# EAGLE board BLE_POV_clock_v2.0 (EAGLE 9.6.2)
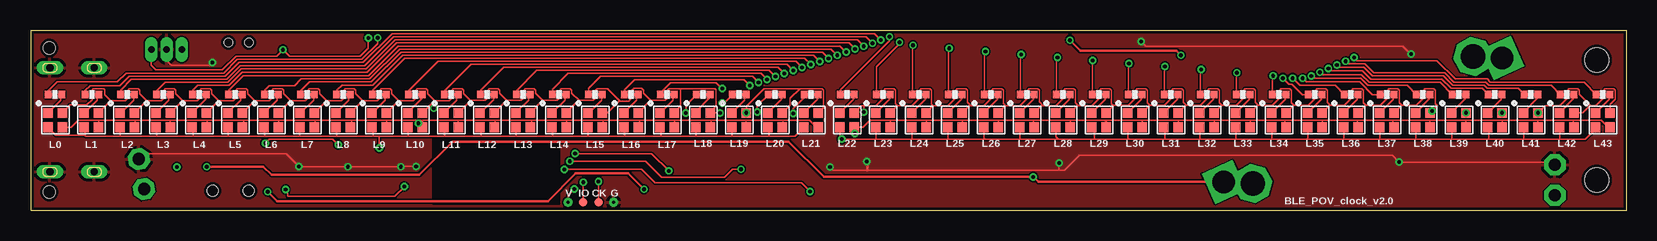
[diagram p2: board, top side]
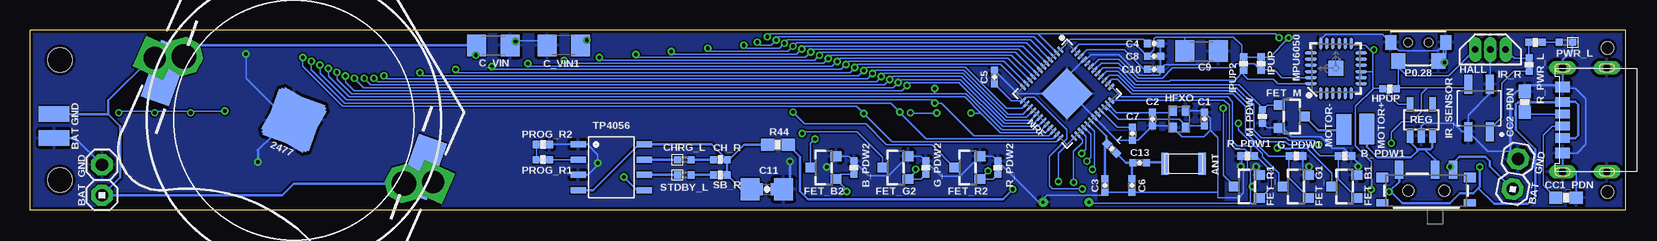
[diagram p3: board, bottom side, seen from below]

Size 133 x 15 mm. Coordinates in mm from the lower left corner, seen from the top.
Outline: 133,0 133,15 0,15 0,0 133,0
Copper layers (1*16): Top 0.035mm / dielectric 1.5mm / Bottom 0.035mm
Design rules "SeeedStudio_2layer_DRU_no_angle_20140221 *": minimum track width 5mil, minimum drill 12mil, track to track 5mil, track to pad 5mil, pad to pad 5mil, via to via 5mil, smd to smd 0mil, copper to edge 10mil, drill to drill 10mil, minimum pad ring 10mil, minimum via ring 6mil, stop-mask expansion 2mil, vias tented up to drill 100mil, thermal gap 10mil
Net classes: 1 pwr: width 0.203 mm
Holes 2 mm at 130.5,2.5 130.5,12.5
Holes 1 mm at 1.5,13.5 1.5,1.5
tRestrict: area 33.5,0.5 to 44,6.5
bRestrict: area 33.5,0.5 to 44,6.5

## Footprints (pad centres in the part's own frame; a part is rotated, then mirrored left to right if it is on the bottom)
CR2477_PTH = smd 4.064 x 4.064: GND 0,0 | drill 1.854 square: V+1 -12.7,0; V+2 12.7,0
ANT3216LL00R2400A = smd 1.8 x 0.6: P1 0,1.55; P2 0,-1.55
0402-RES = smd 0.6 x 0.6: 1 -0.55,0; 2 0.55,0
1X02 = drill 1.016 pad 1.778 octagon: 1 -1.27,0; 2 1.27,0
PAD_50X100MIL = smd 1.27 x 2.54: P$1 0,0
0402-CAP = smd 0.6 x 0.6: 1 -0.55,0; 2 0.55,0
1206 = smd 1.6 x 1.8: 1 -1.4,0; 2 1.4,0
0603|1206 = smd 1.1 x 1: 1 -0.85,0; 2 0.85,0 | smd 1.6 x 1.8: P$1 -1.4,0; P$2 1.4,0
0603-RES = smd 1.1 x 1: 1 -0.85,0; 2 0.85,0
0402 = smd 0.6 x 0.6: A -0.55,0; C 0.55,0
SOT23-3 = smd 0.8 x 0.9: 1 -0.95,-1; 2 0.95,-1; 3 0,1.1
TO92_HALLSENSOR = drill 0.55 pad 1.016 long: GND 0,0; OUT -1.27,0; VCC 1.27,0
XTAL_CX2016DB16000D0WZRC1 = smd 0.8 x 0.7: 1 -0.7,-0.55; 2 0.7,-0.55; 3 0.7,0.55; 4 -0.7,0.55
SOIC180P460X187-4N = smd 0.69 x 1.57: 1 -0.9,1.975; 2 -0.9,-1.975; 3 0.9,-1.975; 4 0.9,1.975
0402' = smd 0.6 x 0.6: 1 -0.55,0; 2 0.55,0
LED_RGB_0606 = smd 0.8 x 0.8: B -0.6,-0.6; COM -0.6,0.6; G 0.6,-0.6; R 0.6,0.6
QFN-24-EP = smd 1.016 x 0.254: 1 -2.066,1.257; 2 -2.066,0.75; 3 -2.066,0.247; 4 -2.066,-0.287; 5 -2.066,-0.792; 6 -2.066,-1.297; 13 2.086,-1.297; 14 2.086,-0.792; 15 2.086,-0.287; 16 2.086,0.247; 17 2.086,0.75; 18 2.086,1.257 | smd 0.254 x 1.016: 7 -1.267,-2.122; 8 -0.762,-2.122; 9 -0.258,-2.122; 10 0.278,-2.122; 11 0.78,-2.122; 12 1.287,-2.122; 19 1.287,2.082; 20 0.78,2.082; 21 0.278,2.082; 22 -0.258,2.082; 23 -0.762,2.082; 24 -1.267,2.082 | smd 1.27 x 1.27: P$1 0.02,-0.01
NRF52810_QFN40P600X600X90-48_N_3MMTHERMAL = smd 0.65 x 0.2: 1 -3,2.2; 2 -3,1.8; 3 -3,1.4; 4 -3,1; 5 -3,0.6; 6 -3,0.2; 7 -3,-0.2; 8 -3,-0.6; 9 -3,-1; 10 -3,-1.4; 11 -3,-1.8; 12 -3,-2.2; 25 3,-2.2; 26 3,-1.8; 27 3,-1.4; 28 3,-1; 29 3,-0.6; 30 3,-0.2; 31 3,0.2; 32 3,0.6; 33 3,1; 34 3,1.4; 35 3,1.8; 36 3,2.2 | smd 0.2 x 0.65: 13 -2.2,-3; 14 -1.8,-3; 15 -1.4,-3; 16 -1,-3; 17 -0.6,-3; 18 -0.2,-3; 19 0.2,-3; 20 0.6,-3; 21 1,-3; 22 1.4,-3; 23 1.8,-3; 24 2.2,-3; 37 2.2,3; 38 1.8,3; 39 1.4,3; 40 1,3; 41 0.6,3; 42 0.2,3; 43 -0.2,3; 44 -0.6,3; 45 -1,3; 46 -1.4,3; 47 -1.8,3; 48 -2.2,3 | smd 3 x 3: PAD 0,0
2X4X3.5MM = smd 1.15 x 1.3: 1 -1.675,-1.55; 2 1.675,-1.55 | smd 0.9 x 1.2: GND -2.3,0; GND2 2.3,0 | hole 0.7: -0.85,0; 0.85,0
SOT23-5 = smd 0.55 x 1.2: 1 -0.95,-1.3; 2 0,-1.3; 3 0.95,-1.3; 4 0.95,1.3; 5 -0.95,1.3
SOP8 = smd 1.3 x 0.5: P$1 -2.75,1.905; P$2 -2.75,0.635; P$3 -2.75,-0.635; P$4 -2.75,-1.905; P$5 2.75,-1.905; P$6 2.75,-0.635; P$7 2.75,0.635; P$8 2.75,1.905
GV_SWD_1.27MM_4P_SEMI_SMD = drill 0.25 pad 0.7: GND 1.905,0; VCC -1.905,0 | smd 0.7 x 0.7: SWDCLK 0.635,0; SWDIO -0.635,0
CR2032_CHINA_HOLDER = drill 2.03 octagon: +1 -10.6,0; +2 10.6,0 | smd 4 x 4: - 0,0
SMD_SWITCH = smd 0.7 x 1.5: 1 -2.25,-1.75; 2 -0.75,-1.75; 3 2.25,-1.75 | smd 1 x 0.6: GND1 -3.65,1; GND3 3.65,1 | smd 1 x 0.8: GND2 -3.65,-1.1; GND4 3.65,-1.1 | hole 0.9: -1.5,0; 1.5,0
USCX-06FX-XXMX-01 = smd 0.7 x 1.2: CC1 0.5,-1.75; CC2 -0.5,-1.75 | smd 0.9 x 1.2: GND1 2.75,-1.75; GND2 -2.75,-1.75 | drill 0.6 long: SHIELD1 4.325,1.95; SHIELD2 4.325,-1.75; SHIELD3 -4.35,-1.75; SHIELD4 -4.35,1.95 | smd 0.8 x 1.2: VBUS1 1.5,-1.75; VBUS2 -1.5,-1.75
CR2032 = smd 4.064 x 4.064: GND 0,0 | smd 2.5 x 5: V+5 -11.45,0; V+6 11.45,0

## Placement (x,y rotation side)
2477  CR2477  [CR2477_PTH]  111,7.5 156 bottom
ANT  ANT3216LL00R2400A  [ANT3216LL00R2400A]  36.84,3.86 90 bottom
B_PDW1  100k  [0402-RES]  23.38,4.5 0 bottom
B_PDW2  100k  [0402-RES]  64.32,3.53 90 bottom
BAT  PINH1X02  [1X02]  127,2.5 270 bottom
BAT1  PINH1X02  [1X02]  9.18,3 260 bottom
BAT+  PAD_50X100MIL  [PAD_50X100MIL]  131,6 270 bottom
C1  12pF  [0402-CAP]  35.11,7.57 270 bottom
C2  12pF  [0402-CAP]  39.43,7.57 90 bottom
C3  0.5pF  [0402-CAP]  43.39,2.03 270 bottom
C4  100nF  [0402-CAP]  39.3,13.87 0 bottom
C5  100nF  [0402-CAP]  52.6,11.08 90 bottom
C6  0.5pF  [0402-CAP]  41.16,2.03 270 bottom
C7  100pF  [0402-CAP]  41.09,6.35 90 bottom
C8  100nF  [0402-CAP]  39.3,12.8 180 bottom
C9  4.7uF  [1206]  35.34,13.24 0 bottom
C10  1uF  [0402-CAP]  39.3,11.73 180 bottom
C11  [0603|1206]  71.58,1.73 0 bottom
C13  18pF  [0402-CAP]  40.49,3.95 0 bottom
C_VIN  100uF  [1206]  94.38,13.72 0 bottom
C_VIN1  100uF  [1206]  88.51,13.72 180 bottom
CC1_PDN  [0603-RES]  4.97,1.02 180 bottom
CC2_PDN  [0603-RES]  8.4,9.02 270 bottom
CH_R  1k  [0402-RES]  75.46,4.19 180 bottom
CHRG_L  LED_0402  [0402]  78.46,4.19 180 bottom
FET_B1  AO3400  [SOT23-3]  23.38,1.96 90 bottom
FET_B2  AO3400  [SOT23-3]  66.82,3.53 90 bottom
FET_G1  AO3400  [SOT23-3]  27.45,1.96 90 bottom
FET_G2  AO3400  [SOT23-3]  60.82,3.53 90 bottom
FET_M  AO3400  [SOT23-3]  27.85,7.79 270 bottom
FET_R1  AO3400  [SOT23-3]  31.51,1.96 90 bottom
FET_R2  AO3400  [SOT23-3]  54.82,3.53 90 bottom
G_PDW1  100k  [0402-RES]  27.45,4.5 0 bottom
G_PDW2  100k  [0402-RES]  58.32,3.53 90 bottom
GND_1  PAD_50X100MIL  [PAD_50X100MIL]  131,8 270 bottom
HALL  49E  [TO92_HALLSENSOR]  11.27,13.39 0 bottom
HFXO  32MHz  [XTAL_CX2016DB16000D0WZRC1]  37.19,7.57 270 bottom
HPUP  100k  [0402-RES]  19.66,10.1 0 bottom
IPUP  100k  [0402-RES]  30.38,12.19 270 bottom
IPUP2  100k  [0402-RES]  31.84,12.19 270 bottom
IR_R  100k  [0402-RES]  8.03,12.11 270 bottom
IR_SENSOR  QRE1113GR  [SOIC180P460X187-4N]  12.21,8.49 180 bottom
L  3.9nH  [0402']  42.83,5.12 315 bottom
L0  RGB_LED_ANODE_(+)_0606  [LED_RGB_0606]  2,7.5 0 top
L1  RGB_LED_ANODE_(+)_0606  [LED_RGB_0606]  5,7.5 0 top
L2  RGB_LED_ANODE_(+)_0606  [LED_RGB_0606]  8,7.5 0 top
L3  RGB_LED_ANODE_(+)_0606  [LED_RGB_0606]  11,7.5 0 top
L4  RGB_LED_ANODE_(+)_0606  [LED_RGB_0606]  14,7.5 0 top
L5  RGB_LED_ANODE_(+)_0606  [LED_RGB_0606]  17,7.5 0 top
L6  RGB_LED_ANODE_(+)_0606  [LED_RGB_0606]  20,7.5 0 top
L7  RGB_LED_ANODE_(+)_0606  [LED_RGB_0606]  23,7.5 0 top
L8  RGB_LED_ANODE_(+)_0606  [LED_RGB_0606]  26,7.5 0 top
L9  RGB_LED_ANODE_(+)_0606  [LED_RGB_0606]  29,7.5 0 top
L10  RGB_LED_ANODE_(+)_0606  [LED_RGB_0606]  32,7.5 0 top
L11  RGB_LED_ANODE_(+)_0606  [LED_RGB_0606]  35,7.5 0 top
L12  RGB_LED_ANODE_(+)_0606  [LED_RGB_0606]  38,7.5 0 top
L13  RGB_LED_ANODE_(+)_0606  [LED_RGB_0606]  41,7.5 0 top
L14  RGB_LED_ANODE_(+)_0606  [LED_RGB_0606]  44,7.5 0 top
L15  RGB_LED_ANODE_(+)_0606  [LED_RGB_0606]  47,7.5 0 top
L16  RGB_LED_ANODE_(+)_0606  [LED_RGB_0606]  50,7.5 0 top
L17  RGB_LED_ANODE_(+)_0606  [LED_RGB_0606]  53,7.5 0 top
L18  RGB_LED_ANODE_(+)_0606  [LED_RGB_0606]  56,7.5 0 top
L19  RGB_LED_ANODE_(+)_0606  [LED_RGB_0606]  59,7.5 0 top
L20  RGB_LED_ANODE_(+)_0606  [LED_RGB_0606]  62,7.5 0 top
L21  RGB_LED_ANODE_(+)_0606  [LED_RGB_0606]  65,7.5 0 top
L22  RGB_LED_ANODE_(+)_0606  [LED_RGB_0606]  68,7.5 0 top
L23  RGB_LED_ANODE_(+)_0606  [LED_RGB_0606]  71,7.5 0 top
L24  RGB_LED_ANODE_(+)_0606  [LED_RGB_0606]  74,7.5 0 top
L25  RGB_LED_ANODE_(+)_0606  [LED_RGB_0606]  77,7.5 0 top
L26  RGB_LED_ANODE_(+)_0606  [LED_RGB_0606]  80,7.5 0 top
L27  RGB_LED_ANODE_(+)_0606  [LED_RGB_0606]  83,7.5 0 top
L28  RGB_LED_ANODE_(+)_0606  [LED_RGB_0606]  86,7.5 0 top
L29  RGB_LED_ANODE_(+)_0606  [LED_RGB_0606]  89,7.5 0 top
L30  RGB_LED_ANODE_(+)_0606  [LED_RGB_0606]  92,7.5 0 top
L31  RGB_LED_ANODE_(+)_0606  [LED_RGB_0606]  95,7.5 0 top
L32  RGB_LED_ANODE_(+)_0606  [LED_RGB_0606]  98,7.5 0 top
L33  RGB_LED_ANODE_(+)_0606  [LED_RGB_0606]  101,7.5 0 top
L34  RGB_LED_ANODE_(+)_0606  [LED_RGB_0606]  104,7.5 0 top
L35  RGB_LED_ANODE_(+)_0606  [LED_RGB_0606]  107,7.5 0 top
L36  RGB_LED_ANODE_(+)_0606  [LED_RGB_0606]  110,7.5 0 top
L37  RGB_LED_ANODE_(+)_0606  [LED_RGB_0606]  113,7.5 0 top
L38  RGB_LED_ANODE_(+)_0606  [LED_RGB_0606]  116,7.5 0 top
L39  RGB_LED_ANODE_(+)_0606  [LED_RGB_0606]  119,7.5 0 top
L40  RGB_LED_ANODE_(+)_0606  [LED_RGB_0606]  122,7.5 0 top
L41  RGB_LED_ANODE_(+)_0606  [LED_RGB_0606]  125,7.5 0 top
L42  RGB_LED_ANODE_(+)_0606  [LED_RGB_0606]  128,7.5 0 top
L43  RGB_LED_ANODE_(+)_0606  [LED_RGB_0606]  131,7.5 0 top
M_PDW  100k  [0402-RES]  30.27,7.79 270 bottom
MOTOR+  PAD_50X100MIL  [PAD_50X100MIL]  21.57,6.74 180 bottom
MOTOR-  PAD_50X100MIL  [PAD_50X100MIL]  23.49,6.73 180 bottom
MPU6050  MPU-6000  [QFN-24-EP]  24.15,11.8 90 bottom
NRF  NORDIC_NRF_NRF52810_QF  [NRF52810_QFN40P600X600X90-48_N_3MMTHERMAL]  46.55,9.69 315 bottom
P0.28  PUSHBUTTON_2X4X3.5  [2X4X3.5MM]  17.27,13.97 0 bottom
PROG_R1  10k  [0402-RES]  90.24,4.19 180 bottom
PROG_R2  10k  [0402-RES]  90.24,5.46 0 bottom
PWR_L  LED_0402  [0402]  4.97,13.97 0 bottom
R0  220  [0402-RES]  1.97,9.62 0 top
R1  220  [0402-RES]  5.05,9.62 0 top
R2  220  [0402-RES]  8,9.62 0 top
R3  220  [0402-RES]  11,9.62 0 top
R4  220  [0402-RES]  14,9.62 0 top
R5  220  [0402-RES]  17,9.62 0 top
R6  220  [0402-RES]  20,9.62 0 top
R7  220  [0402-RES]  23,9.62 0 top
R8  220  [0402-RES]  26,9.62 0 top
R9  220  [0402-RES]  29,9.62 0 top
R10  220  [0402-RES]  32,9.62 0 top
R11  220  [0402-RES]  35,9.62 0 top
R12  220  [0402-RES]  38,9.62 0 top
R13  220  [0402-RES]  41,9.62 0 top
R14  220  [0402-RES]  44,9.62 0 top
R15  220  [0402-RES]  47,9.62 0 top
R16  220  [0402-RES]  50,9.62 0 top
R17  220  [0402-RES]  53,9.62 0 top
R18  220  [0402-RES]  56,9.62 0 top
R19  220  [0402-RES]  59,9.62 0 top
R20  220  [0402-RES]  62,9.62 0 top
R21  220  [0402-RES]  65,9.62 0 top
R22  220  [0402-RES]  68,9.62 0 top
R23  220  [0402-RES]  71,9.62 0 top
R24  220  [0402-RES]  74,9.62 0 top
R25  220  [0402-RES]  77,9.62 0 top
R26  220  [0402-RES]  80,9.62 0 top
R27  220  [0402-RES]  83,9.62 0 top
R28  220  [0402-RES]  86,9.62 0 top
R29  220  [0402-RES]  89,9.62 0 top
R30  220  [0402-RES]  92,9.62 0 top
R31  220  [0402-RES]  95,9.62 0 top
R32  220  [0402-RES]  98,9.62 0 top
R33  220  [0402-RES]  101,9.62 0 top
R34  220  [0402-RES]  104,9.62 0 top
R35  220  [0402-RES]  107,9.62 0 top
R36  220  [0402-RES]  110,9.62 0 top
R37  220  [0402-RES]  113,9.62 0 top
R38  220  [0402-RES]  116,9.62 0 top
R39  220  [0402-RES]  119,9.62 0 top
R40  220  [0402-RES]  122,9.62 0 top
R41  220  [0402-RES]  125,9.62 0 top
R42  220  [0402-RES]  128,9.62 0 top
R43  220  [0402-RES]  131,9.62 0 top
R44  [0603-RES]  70.65,5.44 0 bottom
R_PDW1  100k  [0402-RES]  31.51,4.5 180 bottom
R_PDW2  100k  [0402-RES]  52.32,3.53 90 bottom
R_PWR_L  10k  [0402-RES]  7.51,13.97 0 bottom
REG  MIC5219-BM5  [SOT23-5]  17.02,7.51 0 bottom
SB_R  1k  [0402-RES]  75.46,2.92 180 bottom
STDBY_L  LED_0402  [0402]  78.46,2.92 180 bottom
TP4056  TP4056_SOP8  [SOP8]  84.55,3.56 0 bottom
U$2  GV_SWD_4P  [GV_SWD_1.27MM_4P_SEMI_SMD]  46.64,0.65 0 top
U$7  [GV_5MM_METAL]  109,3 0 top
U$11  CR2032CHINA  [CR2032_CHINA_HOLDER]  111,7.5 330 bottom
U$16  SMD_SWITCH  [SMD_SWITCH]  16.61,1.6 180 bottom
U$19  USB-C_6PIN  [USCX-06FX-XXMX-01]  3.5,7.5 270 bottom
U$20  CR2032-SMD  [CR2032]  111,7.5 340 bottom

## Tracks (layer width: path | path; a pad name or v marks a point on that pad's centre or on a via)
3V3  (via drill 0.3 pad 0.5)
  Top 0.127: U$2.VCC 44.73,1.22 v45.27,1.75 | v31.1,1.96 30.29,1.15 21.35,1.15 21.35,1.55 v21.2,1.7 | HALL.VCC 10,12.06 10.38,11.68 15.92,11.68 17.06,12.83 20.44,12.83 v20.97,13.36 21.53,12.8 27.42,12.8 28.08,13.46 v28.08,14.33
  Bottom 0.127: C5.1 51.2,9.12 NRF.13 49.95,9.4 49.28,9.4 46.56,6.67 46.56,5.93 48.01,4.47 48.01,2.01 47.76,1.75 v45.27,1.75 | NRF.48 45.55,13.79 40.84,13.79 C8.2 39.3,13.35 39.3,14.26 39.16,14.4 36.73,14.4 | NRF.36 42.84,9.15 33.46,9.15 33.02,8.71 33.02,5.64 32.46,5.08 31.72,5.08 31.51,4.87 31.51,3.48 31.26,3.23 31.26,2.12 v31.1,1.96 31.26,1.79 31.26,0.57 44.66,0.57 U$2.VCC | C9.1 36.73,14.4 | MPU6050.13 22.71,13.74 21.67,13.74 21.25,13.33 | MPU6050.8 MPU6050.9 21.05,11.54 | 21.25,13.33 21.05,13.12 21.05,11.54 | 21.25,13.33 21.25,13.36 v20.97,13.36 | 21.05,11.54 21.05,10.16 21,10.16 | 21,10.16 20.27,10.16 HPUP.1 18.92,8.81 REG.5 | 36.73,14.4 32.69,14.4 32,13.72 32,12.91 IPUP2.1 IPUP.1 29.66,12.74 v28.08,14.33 | HALL.VCC 9.27,12.66 IR_R.1 8.06,12.69 R_PWR_L.1 | 21,10.16 22.52,8.64 22.52,5.33 21.2,4.01 v21.2,1.7
BAT  (via drill 0.3 pad 0.5)
  Top 0.203: v14.61,3.61 19.35,3.61 20.03,2.92 32.35,2.92 35.12,5.69 63.14,5.69 66.07,2.76 v83.51,2.76 83.94,2.33 2477.V+1 | v95.83,12.9 95.45,13.28 87.44,13.28 v86.57,14.15
  Bottom 0.203: TP4056.P$5 82.4,1.65 v83.51,2.76 | v95.83,12.9 95.83,13.66 C_VIN.1 119.26,13.72 U$11.+1 121.98,11 122,11 122,11.18 U$20.V+5 121.76,11.82 2477.V+2 122.95,12.67 126.49,9.13 | C_VIN1.1 86.67,14.15 v86.57,14.15 | U$16.1 v14.61,3.61 14.61,3.67 13.84,4.45 11.7,4.45 11.3,4.05 11.3,3.65 BAT1.2 | 126.49,9.13 126.49,8 126.5,8 | 2477.V+1 99.4,2.74 U$20.V+6 100.44,3.58 U$11.+2 111.03,2.2 112,1.23 BAT.2 125.49,2.74 125.49,6.99 126.5,8 | 126.49,9.13 | 126.5,8 GND_1.P$1
BLUE1  (via drill 0.3 pad 0.5)
  Top 0.127: L0.B 2.05,6.25 4.48,6.25 | 61.5,6.15 63.65,6.15 L21.B | 61.5,6.15 58.4,6.15 | 58.4,6.15 55.41,6.15 | 55.41,6.15 52.48,6.15 | 52.48,6.15 49.44,6.15 | 49.44,6.15 46.39,6.15 | 46.39,6.15 43.47,6.15 | 43.47,6.15 40.42,6.15 | 40.42,6.15 37.5,6.15 | 37.5,6.15 34.45,6.15 | 34.45,6.15 31.4,6.15 | 25.43,6.15 22.39,6.15 | 22.39,6.15 19.46,6.15 | 19.46,6.15 16.42,6.15 | 16.42,6.15 13.5,6.15 | 13.5,6.15 10.45,6.15 | 10.45,6.15 7.4,6.15 | 7.4,6.15 4.48,6.15 4.48,6.25 | 4.48,6.25 4.48,6.86 L1.B | 7.4,6.15 7.4,6.86 L2.B | 10.45,6.15 10.45,6.86 L3.B | 13.5,6.15 13.5,6.86 L4.B | 16.42,6.15 16.42,6.86 L5.B | 19.46,6.15 19.46,6.86 L6.B | 22.39,6.15 22.39,6.86 L7.B | 25.43,6.15 25.43,6.86 L8.B | 28.48,6.15 28.48,6.86 L9.B | 31.4,6.15 31.4,6.86 L10.B | 34.45,6.15 34.45,6.86 L11.B | 37.5,6.15 37.5,6.86 L12.B | 40.42,6.15 40.42,6.86 L13.B | 43.47,6.15 43.47,6.86 L14.B | 46.39,6.15 46.39,6.86 L15.B | 49.44,6.15 49.44,6.86 L16.B | 52.48,6.15 52.48,6.86 L17.B | 55.41,6.15 55.41,6.86 L18.B | 58.4,6.15 L19.B | 61.5,6.15 61.5,6.86 L20.B | 28.48,6.15 25.43,6.15 | 28.48,6.15 29,6.15 | 29,6.15 31.4,6.15 | v29.01,5.15 29,5.17 29,6.15
  Bottom 0.127: FET_B1.3 24.48,3.06 26.58,5.15 v29.01,5.15
BLUE2  (via drill 0.3 pad 0.5)
  Top 0.127: L43.B 130.4,6.74 129.55,5.89 127.4,5.89 | 70.4,5.89 67.58,5.89 v67.56,5.91 67.4,6.06 L22.B | 70.4,5.89 73.4,5.89 | 73.4,5.89 76.4,5.89 | 76.4,5.89 79.5,5.89 | 79.5,5.89 82.4,5.89 | 82.4,5.89 85.6,5.89 | 88.62,5.89 91.5,5.89 | 91.5,5.89 94.5,5.89 | 94.5,5.89 97.4,5.89 | 97.4,5.89 100.4,5.89 | 100.4,5.89 103.4,5.89 | 103.4,5.89 106.3,5.89 | 121.5,5.89 124.4,5.89 | L23.B 70.4,5.89 | L24.B 73.4,5.89 | L25.B 76.4,5.89 | L26.B 79.4,5.99 79.5,5.89 | L27.B 82.4,5.89 | L28.B 85.4,6.09 85.6,5.89 | 88.62,5.89 88.62,6.86 88.42,6.86 L29.B | L30.B 91.4,5.99 91.5,5.89 | 94.5,5.89 94.5,6.86 94.52,6.86 L31.B | L32.B 97.4,5.89 | L33.B 100.4,5.89 | L34.B 103.4,5.89 | L35.B 106.4,5.99 106.3,5.89 | L39.B 118.4,5.89 | L40.B 121.5,6.8 121.5,5.89 | L41.B 124.4,5.89 | L42.B 127.4,5.89 | 124.4,5.89 127.4,5.89 | 106.3,5.89 109.36,5.89 | 121.5,5.89 118.4,5.89 | L36.B 109.4,5.92 109.36,5.89 | 85.6,5.89 88.62,5.89 | 118.4,5.89 115.33,5.89 | 109.36,5.89 112.41,5.89 | 112.41,5.89 115.33,5.89 | L38.B 115.4,5.96 115.33,5.89 | L37.B 112.4,5.9 112.41,5.89
  Bottom 0.127: FET_B2.3 67.92,5.55 v67.56,5.91
BLUE_S1
  Bottom 0.127: NRF.39 43.04,11.22 42.33,11.22 41.04,9.93 32.58,9.93 31.32,8.68 31.32,6.61 30.4,5.69 28.34,5.69 28.08,5.43 26.37,5.43 25.47,4.53 23.94,4.53 B_PDW1.1 23.94,2.56 FET_B1.1
BLUE_S2  (via drill 0.3 pad 0.5)
  Top 0.127: v64.91,1.55 64.19,2.26 52,2.26 50.88,3.38 v44.43,3.38
  Bottom 0.127: NRF.29 44.28,6.58 44.28,3.53 v44.43,3.38 | v64.91,1.55 64.91,1.66 FET_B2.1 65.42,2.98 B_PDW2.1
CHARGER_VIN
  Bottom 0.203: CH_R.1 SB_R.1 73.72,1.73 C11.P$1 C11.1 | R44.1 73.5,5.44 74.74,4.19 CH_R.1 | CH_R.1 76.18,5.46 TP4056.P$8 82.24,5.46 86.05,1.65 TP4056.P$4
FET_M
  Bottom 0.127: NRF.41 44,11.41 43.57,11.84 42.23,11.84 40.85,10.46 32.21,10.46 30.27,8.52 M_PDW.1 29.87,8.74 FET_M.1
GND  (via drill 0.3 pad 0.5)
  Top 0.127: 85.59,3.33 69.72,3.33 66.83,3.33 v66.58,3.58 | v92.52,14.05 92.91,13.66 114.33,13.66 v115,13 | v85.67,3.91 85.67,3.4 85.59,3.33 | 85.59,3.33 86.14,3.33 87.37,4.56 113.44,4.56 v114,4 126.77,4 BAT.1 | HALL.GND 11.27,12.45 11.65,12.06 14.87,12.06 v15.09,12.29 | v32.07,3.63 30.82,3.63 v30.79,3.61 v26.38,3.61 22.32,3.61 v22.29,3.63 21.25,4.67 9.24,4.67 BAT1.1
  Top 0.203: v69.64,4.04 69.72,3.96 69.72,3.33
  Bottom 0.127: C5.2 50.67,9.69 NRF.PAD 46.55,9.97 | C4.2 C8.1 C10.1 | 46.55,9.97 46.55,11.1 NRF.45 44.98,12.52 44.58,12.92 42.21,12.92 40.52,11.22 38.91,11.22 38.75,11.38 C10.1 | 46.55,9.97 NRF.31 42.38,5.8 C7.1 40.64,5.8 C2.1 37.89,7.02 HFXO.2 36.99,6.12 35.14,6.12 34.62,6.64 | M_PDW.2 29.87,6.84 FET_M.2 28.58,6.84 27.83,6.09 25.41,6.09 24.44,5.13 23.47,5.13 B_PDW1.2 22.29,3.95 v22.29,3.63 22.29,3 FET_B1.2 | P0.28.GND2 15.19,13.75 15.19,12.42 P0.28.2 | P0.28.GND2 15.66,13.28 18.89,13.28 P0.28.GND 20.26,14.66 24.97,14.66 25.41,14.22 MPU6050.18 | v15.09,12.29 14.97,12.42 P0.28.GND2 | C10.1 38.4,12.09 34.94,12.09 33.94,13.09 C9.2 | v66.58,3.58 66.46,3.58 65.82,4.22 FET_B2.2 64.72,4.48 B_PDW2.2 63.09,2.85 61.45,2.85 FET_G2.2 58.72,4.48 G_PDW2.2 57.03,2.79 55.5,2.79 FET_R2.2 52.72,4.48 R_PDW2.2 48.89,0.65 U$2.GND 48.54,0.93 48.25,1.22 43.39,1.22 C3.2 | 41.18,1.48 34,1.48 | C3.2 41.18,1.48 | HFXO.4 35.26,8.27 C1.1 34.62,7.63 34.62,6.64 | C3.2 | 41.18,1.48 C6.2 | C_VIN1.2 90.29,14.1 92.47,14.1 v92.52,14.05 92.85,13.72 C_VIN.2 | PROG_R2.2 TP4056.P$1 86.51,5.46 85.67,4.62 v85.67,3.91 85.67,3.73 86.48,2.92 TP4056.P$3 | U$20.GND 111.5,7.5 115,11 v115,13 | R_PDW1.2 32,4.43 32,3.7 v32.07,3.63 31.84,3.4 31.84,1.43 32.25,1.02 34,1.02 34,1.48 | G_PDW1.2 26.9,3.36 FET_G1.2 26.45,3.54 v26.38,3.61 | HALL.GND 11.27,10.51 IR_SENSOR.2 11.31,9.71 13.11,7.91 IR_SENSOR.4 | 34,1.48 34,6.02 34.62,6.64 | REG.2 17.02,7 16.78,7.24 14.34,7.24 13.62,6.52 IR_SENSOR.4 | FET_R1.2 30.51,3.33 v30.79,3.61 | 9.59,4.88 11.48,4.88 IR_SENSOR.4 | PWR_L.C 4.42,13.34 5.25,12.51 U$19.SHIELD3 | U$19.SHIELD3 U$19.SHIELD4
  Bottom 0.127: U$19.SHIELD2 U$19.GND1 4.03,4.75 3.32,5.46 3.32,9.27 4.21,10.16 5.16,10.16 U$19.GND2 5.25,10.41 U$19.SHIELD3 | U$19.SHIELD2 U$19.SHIELD1 | CC2_PDN.1 8.4,10.41 | U$19.SHIELD2 4.12,3.17 CC1_PDN.1
  Bottom 0.203: C11.2 C11.P$2 69.64,2.27 v69.64,4.04 | U$20.GND 111.45,7.5 114.03,5 114,5 v114,4 | BAT+.P$1 129.23,6 BAT.1 | BAT1.1 9.59,4.88 9.59,9.35 8.53,10.41 8.4,10.41 5.25,10.41
  pour Bottom: -0.15,15.42 134.47,15.42 134.47,-0.2 -0.15,-0.2
  pour Top: -0.2,-0.14 -0.2,15.21 134.25,15.21 134.25,-0.14
GREEN1  (via drill 0.3 pad 0.5)
  Top 0.127: L21.G 65.47,6.9 64.88,7.49 62.64,7.49 | L0.G 3.33,6.9 3.92,7.49 5.62,7.49 | 62.64,7.49 59.6,7.49 | 59.6,7.49 56.67,7.49 | 56.67,7.49 53.63,7.49 | 53.63,7.49 50.71,7.49 | 50.71,7.49 47.66,7.49 | 47.66,7.49 44.61,7.49 | 44.61,7.49 41.69,7.49 | 41.69,7.49 38.64,7.49 | 38.64,7.49 35.59,7.49 | 35.59,7.49 32.62,7.49 | 32.62,7.49 32.61,7.49 32.56,7.44 | v32.27,7.23 32.35,7.23 32.56,7.44 | 29.62,7.49 26.7,7.49 | 26.7,7.49 23.66,7.49 | 23.66,7.49 20.61,7.49 | 20.61,7.49 17.69,7.49 | 17.69,7.49 14.64,7.49 | 14.64,7.49 11.59,7.49 | 11.59,7.49 8.67,7.49 | 8.67,7.49 5.62,7.49 | 5.62,7.49 5.62,6.99 L1.G | 8.67,7.49 8.67,6.99 L2.G | 11.59,7.49 11.59,6.99 L3.G | 14.64,7.49 14.64,6.99 L4.G | 17.69,7.49 17.69,6.99 L5.G | 20.61,7.49 20.61,6.99 L6.G | 23.66,7.49 23.66,6.99 L7.G | 26.7,7.49 26.7,6.99 L8.G | 29.62,7.49 29.62,6.99 L9.G | 32.62,7.49 32.62,6.92 L10.G | 35.59,7.49 35.59,6.99 L11.G | 38.64,7.49 38.64,6.99 L12.G | 41.69,7.49 41.69,6.99 L13.G | 44.61,7.49 44.61,6.99 L14.G | 47.66,7.49 47.66,6.99 L15.G | 50.71,7.49 50.71,6.99 L16.G | 53.63,7.49 53.63,6.99 L17.G | 56.67,7.49 56.67,6.99 L18.G | 59.6,7.49 59.6,6.99 L19.G | 62.64,7.49 62.64,6.99 L20.G | 32.56,7.44 32.51,7.49 29.62,7.49
  Bottom 0.127: FET_G1.3 28.89,2.29 28.89,3.06 30.26,4.43 30.26,4.68 32.27,6.68 v32.27,7.23
GREEN2  (via drill 0.3 pad 0.5)
  Top 0.127: L40.G 122.6,7.49 | 71.61,7.49 69.92,7.49 69.33,6.9 L22.G 68.64,6.86 v68.64,6.38 | 71.61,7.49 74.61,7.49 | 74.61,7.49 77.53,7.49 | 77.53,7.49 80.6,7.49 | 80.6,7.49 83.52,7.49 | 83.52,7.49 86.6,7.49 | 86.6,7.49 89.47,7.49 | 89.47,7.49 92.51,7.49 | 92.51,7.49 95.64,7.49 | 95.64,7.49 98.56,7.49 | 98.56,7.49 101.66,7.49 | 101.66,7.49 104.48,7.49 | 104.48,7.49 107.6,7.49 | 107.6,7.49 110.52,7.49 | 110.52,7.49 113.5,7.49 | 113.5,7.49 116.57,7.49 | 116.57,7.49 119.59,7.49 | L39.G 119.59,7.49 | L38.G 116.57,6.93 116.57,7.49 | L37.G 113.5,7 113.5,7.49 | L36.G 110.52,6.98 110.52,7.49 | L35.G 107.6,7.49 | L34.G 104.48,7.02 104.48,7.49 | L33.G 101.6,7.43 101.66,7.49 | L32.G 98.6,7.45 98.56,7.49 | L31.G 95.6,7.45 95.64,7.49 | L30.G 92.6,7.41 92.51,7.49 | L29.G 89.6,7.36 89.47,7.49 | L28.G 86.6,7.49 | L27.G 83.52,6.98 83.52,7.49 | L26.G 80.6,7.49 | L25.G 77.6,7.42 77.53,7.49 | L24.G 74.6,7.48 74.61,7.49 | L23.G 71.6,7.48 71.61,7.49 | L43.G 131.47,6.9 130.88,7.49 128.53,7.49 | 128.53,7.49 125.56,7.49 | 125.56,7.49 122.6,7.49 | L41.G 125.56,6.94 125.56,7.49 | L42.G 128.53,6.97 128.53,7.49 | 119.59,7.49 122.6,7.49
  Bottom 0.127: v68.64,6.38 68.48,6.54 64.05,6.54 61.92,4.4 FET_G2.3
GREEN_S1
  Bottom 0.127: NRF.38 42.81,10.88 42.34,10.88 41.15,9.68 32.72,9.68 31.69,8.64 31.69,6.46 29.72,4.5 G_PDW1.1 28.07,4.43 28.07,2.67 26.45,1.05 FET_G1.1
GREEN_S2  (via drill 0.3 pad 0.5)
  Top 0.127: v59.16,3.39 58.44,3.39 57.79,2.74 52.53,2.74 51.21,4.06 v44.89,4.06
  Bottom 0.127: G_PDW2.1 58.72,2.58 FET_G2.1 59.16,3.23 v59.16,3.39 | v44.89,4.06 44.56,4.39 44.56,6.3 NRF.28
LED0  (via drill 0.3 pad 0.5)
  Top 0.127: R22.1 67.45,10.01 71.53,14.1 v71.53,14.44 | R0.1 1.43,9.95 2.16,10.68 7.18,10.68 7.89,11.4 16.01,11.4 17.16,12.55 27.55,12.55 28.87,13.87 v28.87,14.35
  Bottom 0.127: 48.99,14.68 71.29,14.68 v71.53,14.44 | NRF.2 48.99,14.68 | 48.99,14.68 29.2,14.68 v28.87,14.35
LED1  (via drill 0.3 pad 0.5)
  Top 0.127: R23.1 70.45,11.95 72.36,13.85 72.36,13.97 v72.37,13.98 | R1.1 4.5,9.97 4.89,10.37 7.36,10.37 8.14,11.14 16.16,11.14 17.31,12.29 27.68,12.29 30.07,14.68 70.29,14.68 v70.8,14.17
  Bottom 0.127: v72.37,13.98 72.13,13.74 71.23,13.74 v70.8,14.17 70.54,14.43 49.31,14.43 NRF.3
LED2  (via drill 0.3 pad 0.5)
  Top 0.127: R24.1 73.45,13.69 v73.49,13.73 | R2.1 7.45,10 8.34,10.89 16.26,10.89 17.41,12.04 27.8,12.04 30.19,14.43 69.58,14.43 v70.11,13.89
  Bottom 0.127: v73.49,13.73 73.25,13.49 70.52,13.49 v70.11,13.89 69.83,14.17 49.61,14.17 NRF.4
LED3  (via drill 0.3 pad 0.5)
  Top 0.127: R25.1 76.45,13.41 v76.51,13.47 | R3.1 10.45,9.95 11.14,10.64 16.37,10.64 17.49,11.76 27.91,11.76 30.32,14.18 68.87,14.18 v69.4,13.64
  Bottom 0.127: v76.51,13.47 76.27,13.23 69.81,13.23 v69.4,13.64 69.12,13.92 49.92,13.92 NRF.5
LED4  (via drill 0.3 pad 0.5)
  Top 0.127: R26.1 79.45,13.14 v79.53,13.22 | v68.66,13.42 68.17,13.92 30.45,13.92 28.01,11.48 17.57,11.48 16.47,10.38 13.86,10.38 13.45,9.97 R4.1
  Bottom 0.127: v79.53,13.22 79.29,12.98 69.11,12.98 v68.66,13.42 68.42,13.66 50.25,13.66 NRF.6
LED5  (via drill 0.3 pad 0.5)
  Top 0.127: R27.1 82.45,12.91 v82.51,12.97 | R5.1 16.45,10 17.65,11.2 28.11,11.2 30.58,13.67 67.42,13.67 v67.93,13.16
  Bottom 0.127: v82.51,12.97 82.27,12.72 68.36,12.72 v67.93,13.16 67.67,13.41 50.55,13.41 NRF.7
LED6  (via drill 0.3 pad 0.5)
  Top 0.127: R28.1 85.45,12.63 v85.53,12.71 | v67.19,12.89 66.67,13.41 30.7,13.41 28.21,10.92 22.51,10.92 21.95,10.36 19.84,10.36 19.45,9.97 R6.1
  Bottom 0.127: v85.53,12.71 85.29,12.47 67.61,12.47 v67.19,12.89 66.92,13.16 50.86,13.16 NRF.8
LED7  (via drill 0.3 pad 0.5)
  Top 0.127: R29.1 88.45,12.43 v88.48,12.46 | R7.1 22.45,9.92 23.19,10.67 28.34,10.67 30.83,13.16 65.93,13.16 v66.45,12.64
  Bottom 0.127: v88.48,12.46 88.23,12.22 66.87,12.22 v66.45,12.64 66.19,12.9 51.17,12.9 NRF.9
LED8  (via drill 0.3 pad 0.5)
  Top 0.127: R30.1 91.45,12.16 v91.5,12.21 | v65.72,12.38 65.19,12.9 30.96,12.9 28.47,10.41 25.89,10.41 25.45,9.97 R8.1
  Bottom 0.127: v91.5,12.21 91.26,11.96 66.14,11.96 v65.72,12.38 65.45,12.65 51.49,12.65 NRF.10
LED9  (via drill 0.3 pad 0.5)
  Top 0.127: R31.1 94.45,11.9 v94.5,11.95 | R9.1 28.45,9.97 31.13,12.65 64.46,12.65 v64.98,12.13
  Bottom 0.127: v94.5,11.95 94.25,11.71 65.4,11.71 v64.98,12.13 64.71,12.39 51.8,12.39 NRF.11
LED10  (via drill 0.3 pad 0.5)
  Top 0.127: R32.1 97.45,11.63 v97.52,11.7 | v64.24,11.87 63.72,12.4 33.9,12.4 31.45,9.95 R10.1
  Bottom 0.127: v97.52,11.7 97.28,11.46 64.66,11.46 v64.24,11.87 63.98,12.14 52.11,12.14 NRF.12
LED11  (via drill 0.3 pad 0.5)
  Top 0.127: R33.1 100.45,11.4 v100.49,11.44 | R11.1 34.45,9.95 36.64,12.14 62.99,12.14 v63.51,11.62
  Bottom 0.127: v100.49,11.44 100.25,11.2 63.93,11.2 v63.51,11.62 63.24,11.89 55.02,11.89 51.62,8.48 50.3,8.48 NRF.14
LED12  (via drill 0.3 pad 0.5)
  Top 0.127: R34.1 103.45,11.13 v103.51,11.19 | v62.77,11.37 62.25,11.89 39.36,11.89 37.45,9.97 R12.1
  Bottom 0.127: v103.51,11.19 103.27,10.95 63.19,10.95 v62.77,11.37 62.5,11.63 55.13,11.63 51.47,7.98 50.24,7.98 NRF.15
LED13  (via drill 0.3 pad 0.5)
  Top 0.127: R35.1 105.94,9.62 105.08,10.48 104.83,10.48 v104.33,10.99 | R13.1 40.45,9.95 42.13,11.63 61.51,11.63 v62.03,11.11
  Bottom 0.127: v104.33,10.99 104.07,10.73 104.07,10.69 62.45,10.69 v62.03,11.11 61.77,11.38 55.23,11.38 51.58,7.72 49.93,7.72 NRF.16
LED14  (via drill 0.3 pad 0.5)
  Top 0.127: R36.1 108.69,10.38 105.74,10.38 v105.14,10.99 | v61.32,10.88 60.83,11.38 44.75,11.38 43.45,10.08 R14.1
  Bottom 0.127: v105.14,10.99 104.59,10.44 61.77,10.44 v61.32,10.88 61.08,11.12 55.34,11.12 51.68,7.47 49.62,7.47 NRF.17
LED15  (via drill 0.3 pad 0.5)
  Top 0.127: R37.1 111.79,9.62 110.74,10.67 106.27,10.67 v105.96,10.97 | R15.1 46.45,10.13 47.45,11.13 60.1,11.13 v60.61,10.62
  Bottom 0.127: NRF.18 49.3,7.21 51.79,7.21 55.44,10.87 60.36,10.87 v60.61,10.62 61.04,10.19 105.17,10.19 v105.96,10.97
LED16  (via drill 0.3 pad 0.5)
  Top 0.127: R38.1 114.69,10.38 111.41,10.38 110.81,10.99 106.89,10.99 v106.7,11.18 | v59.9,10.36 59.39,10.87 50.3,10.87 49.45,10.03 R16.1
  Bottom 0.127: v106.7,11.18 106.7,10.66 105.96,9.93 60.33,9.93 v59.9,10.36 59.65,10.62 55.55,10.62 51.89,6.96 48.99,6.96 NRF.19
LED17  (via drill 0.3 pad 0.5)
  Top 0.127: R39.1 117.43,10.63 111.54,10.63 110.89,11.29 107.6,11.29 v107.41,11.48 | R17.1 52.45,9.77 53.3,10.62 57.09,10.62 v57.59,10.12
  Bottom 0.127: v107.41,11.48 107.41,10.89 106.19,9.68 57.61,9.68 | NRF.20 48.68,6.71 52,6.71 54.97,9.68 57.61,9.68 | v57.59,10.12 57.61,10.1 57.61,9.68
LED18  (via drill 0.3 pad 0.5)
  Top 0.127: R40.1 120.94,10.13 118.35,10.13 117.59,10.89 111.67,10.89 110.97,11.6 108.31,11.6 v108.12,11.79 | R18.1 54.57,8.74 v54.57,8.08
  Bottom 0.127: v108.12,11.79 108.12,11.14 106.4,9.42 55.08,9.42 53.73,8.08 | 53.73,8.08 52.1,6.45 48.37,6.45 NRF.21 | v54.57,8.08 53.73,8.08
LED19  (via drill 0.3 pad 0.5)
  Top 0.127: R41.1 123.94,10.13 121.38,10.13 121.12,10.38 118.48,10.38 117.69,11.17 111.78,11.17 111.06,11.89 109.03,11.89 v108.83,12.09 | v57.59,8.91 57.61,8.89 57.74,8.89 58.45,9.6 R19.1
  Bottom 0.127: v108.83,12.09 108.83,11.38 106.62,9.17 57.84,9.17 v57.59,8.91 57.03,8.91 54.31,6.2 48.06,6.2 NRF.22
LED20  (via drill 0.3 pad 0.5)
  Top 0.127: v109.54,12.39 109.75,12.18 111.14,12.18 111.89,11.44 117.81,11.44 118.58,10.66 121.23,10.66 121.51,10.38 126.69,10.38 R42.1 | v60.51,8.18 60.51,8.68 R20.1
  Bottom 0.127: v109.54,12.39 109.54,11.68 106.77,8.91 61.22,8.91 60.51,8.2 v60.51,8.18 60.51,8.15 58.3,5.94 47.75,5.94 NRF.23
LED21  (via drill 0.3 pad 0.5)
  Top 0.127: v110.25,12.7 110.51,12.45 117.16,12.45 118.69,10.92 121.35,10.92 121.64,10.63 129.43,10.63 R43.1 | R21.1 64.45,9.39 63.51,8.45 v63.51,8.05
  Bottom 0.127: v110.25,12.7 110.25,11.99 106.92,8.65 64.11,8.65 v63.51,8.05 61.14,5.69 47.44,5.69 NRF.24
LED_R0
  Top 0.127: R0.2 2.45,9.55 2.45,9.14 1.43,8.13 L0.COM
LED_R1
  Top 0.127: R1.2 5.49,9.44 5.49,9.14 4.48,8.13 L1.COM
LED_R2
  Top 0.127: R2.2 8.54,9.53 8.54,9.14 7.53,8.13 L2.COM
LED_R3
  Top 0.127: R3.2 11.46,9.53 11.46,9.14 10.45,8.13 L3.COM
LED_R4
  Top 0.127: R4.2 14.55,9.23 13.5,8.18 13.5,8.13 L4.COM
LED_R5
  Top 0.127: R5.2 17.43,9.53 17.43,9.14 16.42,8.13 L5.COM
LED_R6
  Top 0.127: R6.2 20.48,9.53 20.48,9.14 19.46,8.13 L6.COM
LED_R7
  Top 0.127: R7.2 23.53,9.53 23.53,9.14 22.51,8.13 L7.COM
LED_R8
  Top 0.127: R8.2 26.45,9.53 26.45,9.14 25.43,8.13 L8.COM
LED_R9
  Top 0.127: R9.2 29.5,9.53 29.5,9.14 28.48,8.13 L9.COM
LED_R10
  Top 0.127: R10.2 32.55,9.53 32.55,9.27 31.4,8.13 L10.COM
LED_R11
  Top 0.127: R11.2 35.47,9.53 35.47,9.14 34.45,8.13 L11.COM
LED_R12
  Top 0.127: R12.2 38.55,9.21 37.5,8.15 37.5,8.13 L12.COM
LED_R13
  Top 0.127: R13.2 41.44,9.53 41.44,9.14 40.42,8.13 L13.COM
LED_R14
  Top 0.127: R14.2 44.48,9.53 44.48,9.14 43.47,8.13 L14.COM
LED_R15
  Top 0.127: R15.2 47.53,9.53 47.53,9.14 46.52,8.13 L15.COM
LED_R16
  Top 0.127: R16.2 50.45,9.53 50.45,9.14 49.44,8.13 L16.COM
LED_R17
  Top 0.127: R17.2 53.5,9.53 53.5,9.14 52.48,8.13 L17.COM
LED_R18
  Top 0.127: R18.2 56.55,9.35 55.4,8.2 L18.COM
LED_R19
  Top 0.127: R19.2 59.47,9.53 59.47,9.14 58.45,8.13 L19.COM
LED_R20
  Top 0.127: R20.2 62.55,9.25 L20.COM
LED_R21
  Top 0.127: R21.2 65.55,9.25 L21.COM
LED_R22
  Top 0.127: L22.COM 68.55,9.25 R22.2
LED_R23
  Top 0.127: L23.COM 71.55,9.25 R23.2
LED_R24
  Top 0.127: L24.COM 74.55,9.25 R24.2
LED_R25
  Top 0.127: L25.COM 77.55,9.25 R25.2
LED_R26
  Top 0.127: L26.COM 80.55,9.25 R26.2
LED_R27
  Top 0.127: L27.COM 83.55,9.25 R27.2
LED_R28
  Top 0.127: L28.COM 86.55,9.25 R28.2
LED_R29
  Top 0.127: R29.2 89.55,9.25 L29.COM
LED_R30
  Top 0.127: L30.COM 92.55,9.25 R30.2
LED_R31
  Top 0.127: R31.2 95.55,9.25 L31.COM
LED_R32
  Top 0.127: L32.COM 98.55,9.25 R32.2
LED_R33
  Top 0.127: L33.COM 101.55,9.25 R33.2
LED_R34
  Top 0.127: R34.2 104.55,9.25 L34.COM
LED_R35
  Top 0.127: L35.COM 107.55,9.25 R35.2
LED_R36
  Top 0.127: R36.2 110.55,9.25 L36.COM
LED_R37
  Top 0.127: L37.COM 113.55,9.25 R37.2
LED_R38
  Top 0.127: L38.COM 115.4,8.11 116.55,9.26 R38.2
LED_R39
  Top 0.127: L39.COM 118.4,8.14 119.55,9.29 R39.2
LED_R40
  Top 0.127: L40.COM 121.44,8.1 122.55,9.21 R40.2
LED_R41
  Top 0.127: L41.COM 124.4,8.16 125.55,9.31 R41.2
LED_R42
  Top 0.127: L42.COM 127.4,8.11 128.55,9.26 R42.2
LED_R43
  Top 0.127: L43.COM 130.41,8.1 131.55,9.24 R43.2
MOTOR
  Bottom 0.203: FET_M.3 25.6,6.65 23.57,6.65 MOTOR-.P$1
N$1
  Bottom 0.127: HFXO.3 36.64,6.88 | 36.64,6.88 36.64,7.02 37.17,7.55 42.27,7.55 43.28,8.56 NRF.34 | C1.2 36.51,7.02 36.64,6.88
N$2
  Bottom 0.127: NRF.35 42.43,8.12 C2.2 37.89,8.12 HFXO.1
N$3
  Bottom 0.127: C7.2 42.35,6.9 NRF.33
N$4
  Bottom 0.127: CC2_PDN.2 8.23,8 U$19.CC2
N$5
  Bottom 0.127: PROG_R2.1 PROG_R1.2
N$6
  Bottom 0.127: 81.56,4.19 TP4056.P$7
  Bottom 0.203: CHRG_L.C 81.56,4.19
N$7
  Bottom 0.203: TP4056.P$6 STDBY_L.C
N$8
  Bottom 0.127: C10.2 40.16,11.73 41.77,13.34 44.88,13.34 NRF.46
N$9
  Bottom 0.127: CC1_PDN.2 6.88,2.07 6.88,6.22 6.1,7 U$19.CC1
N$10
  Bottom 0.127: 43.24,5.54 L.1
  Bottom 0.203: NRF.30 43.29,6.15 43.29,5.59 43.24,5.54 43.39,5.38 C3.1
N$11
  Bottom 0.127: NRF.1 46.25,14.22 40.21,14.22 C4.1
N$12
  Bottom 0.127: IR_SENSOR.1 11.31,6.74 10.32,7.74 10.32,10.55 9.3,11.56 IR_R.2
N$14
  Bottom 0.127: TP4056.P$2 PROG_R1.1
N$16
  Bottom 0.203: STDBY_L.A SB_R.2
N$17
  Bottom 0.203: CHRG_L.A CH_R.2
N$18
  Bottom 0.203: C6.1 41.16,3.95 | L.2 41.65,3.95 41.16,3.95 | C13.1 41.16,3.95
N$19
  Bottom 0.203: ANT.P1 38.5,3.96 C13.2
N$30
  Bottom 0.127: R_PWR_L.2 PWR_L.A
RED1  (via drill 0.3 pad 0.5)
  Top 0.127: L14.R 44.61,8.13 45.61,9.13 45.65,9.13 | L20.R 62.64,8.13 63.25,8.74 63.25,9.29 64.07,10.11 | 54.08,10.11 54.13,10.06 54.13,8.64 53.63,8.13 L17.R | 56.67,8.26 56.67,8.13 L18.R | 56.67,8.26 57.06,8.64 57.06,10.03 56.98,10.11 54.08,10.11 | 56.67,8.26 L18.R | L21.R 66.04,8.54 66.04,10 65.93,10.11 64.07,10.11 | L18.R 57.39,8.1 v57.41,8.08 | L15.R 48.03,8.1 49.03,9.1 49.04,9.1 | 49.04,9.1 48.03,10.11 47.17,10.11 46.94,9.88 46.94,9.24 46.83,9.13 45.65,9.13 | 49.04,9.1 49.06,9.08 49.78,9.08 49.94,9.24 49.94,9.88 50.22,10.16 50.88,10.16 51.04,10 51.04,9.72 51.63,9.13 | L13.R 42.63,9.13 | 45.65,9.13 45.04,9.74 45.04,10 44.93,10.11 44.17,10.11 44.06,10 44.06,9.36 43.83,9.13 42.63,9.13 | L12.R 39.63,9.13 | 42.63,9.13 42.04,9.72 42.04,10 41.93,10.11 41.17,10.11 41.06,10 41.06,9.36 40.83,9.13 39.63,9.13 | L11.R 36.61,9.11 | 36.61,9.11 36.63,9.13 37.83,9.13 38.06,9.36 38.06,10 38.17,10.11 38.93,10.11 39.04,10 39.04,9.72 39.63,9.13 | 33.62,9.11 32.98,8.48 | 33.62,9.11 33.61,9.11 33.04,9.69 33.04,10 32.93,10.11 32.17,10.11 32.06,10 32.06,9.36 31.81,9.11 30.61,9.11 | 33.62,9.11 34.81,9.11 35.06,9.36 35.06,10 35.17,10.11 35.93,10.11 36.04,10 36.04,9.69 36.61,9.11 | L9.R 30.61,9.11 | L8.R 27.61,9.11 | 27.61,9.11 28.81,9.11 29.06,9.36 29.06,10 29.17,10.11 29.93,10.11 30.04,10 30.04,9.69 30.61,9.11 | L7.R 24.61,9.11 | 24.61,9.11 25.81,9.11 26.06,9.36 26.06,10 26.17,10.11 26.93,10.11 27.04,10 27.04,9.69 27.61,9.11 | L6.R 21.61,9.11 | 21.61,9.11 22.81,9.11 23.06,9.36 23.06,10 23.17,10.11 23.93,10.11 24.04,10 24.04,9.69 24.61,9.11 | L5.R 18.61,9.11 | 18.61,9.11 19.81,9.11 20.06,9.36 20.06,10 20.17,10.11 20.93,10.11 21.04,10 21.04,9.69 21.61,9.11
  Top 0.127: L4.R 15.61,9.11 | 15.61,9.11 16.81,9.11 17.06,9.36 17.06,10 17.17,10.11 17.93,10.11 18.04,10 18.04,9.69 18.61,9.11 | L3.R 12.61,9.11 | 12.61,9.11 13.81,9.11 14.06,9.36 14.06,10 14.17,10.11 14.93,10.11 15.04,10 15.04,9.69 15.61,9.11 | L2.R 9.61,9.11 | 9.61,9.11 10.81,9.11 11.06,9.36 11.06,10 11.17,10.11 11.93,10.11 12.04,10 12.04,9.69 12.61,9.11 | L1.R 6.61,9.11 | 6.61,9.11 7.81,9.11 8.06,9.36 8.06,10 8.17,10.11 8.93,10.11 9.04,10 9.04,9.69 9.61,9.11 | L0.R 3.26,8.76 4.61,8.76 5.06,9.21 5.06,10 5.17,10.11 6.03,10.11 6.12,10.02 6.12,9.61 6.61,9.11 | L16.R 51.63,9.13 | 51.63,9.13 52.83,9.13 52.94,9.24 52.94,9.88 53.17,10.11 54.08,10.11 | v33.54,8.48 32.98,8.48 | L19.R 59.6,8.64 61.07,10.11 64.07,10.11 | L10.R 32.98,8.48
  Bottom 0.127: v57.41,8.08 59.58,8.08 L19.R | FET_R1.3 32.61,2.02 33.51,2.91 33.51,8.46 v33.54,8.48
  other vias: 59.6,8.1
RED2  (via drill 0.3 pad 0.5)
  Top 0.127: L37.R 114.24,8.74 | 114.24,8.74 115.44,8.74 116.06,9.36 116.06,10 116.17,10.11 116.93,10.11 117.04,10 117.04,8.84 117.19,8.69 v116.75,8.25 L38.R | L36.R 111.24,8.74 | 111.24,8.74 112.44,8.74 113.06,9.36 113.06,10 113.17,10.11 113.93,10.11 114.04,10 114.04,8.94 114.24,8.74 | L35.R 108.24,8.74 108.29,8.74 | 108.29,8.74 109.44,8.74 110.06,9.36 110.06,10 110.17,10.11 110.93,10.11 111.04,10 111.04,8.93 111.24,8.74 | L34.R 105.24,8.74 | 105.24,8.74 106.44,8.74 107.06,9.36 107.06,10 107.17,10.11 107.93,10.11 108.04,10 108.04,8.98 108.29,8.74 | L33.R 102.24,8.74 102.27,8.74 | 102.27,8.74 103.44,8.74 104.06,9.36 104.06,10 104.17,10.11 104.93,10.11 105.04,10 105.04,8.94 105.24,8.74 | L32.R 99.24,8.74 | 99.24,8.74 100.44,8.74 101.06,9.36 101.06,10 101.17,10.11 101.93,10.11 102.04,10 102.04,8.96 102.27,8.74 | L31.R 96.24,8.74 96.3,8.74 | 96.3,8.74 97.44,8.74 98.06,9.36 98.06,10 98.17,10.11 98.93,10.11 99.04,10 99.04,8.93 99.24,8.74 | L30.R 93.24,8.74 93.25,8.74 | 93.25,8.74 94.44,8.74 95.06,9.36 95.06,10 95.17,10.11 95.93,10.11 96.04,10 96.04,8.99 96.3,8.74 | L29.R 90.21,8.71 | 90.21,8.71 90.24,8.74 91.44,8.74 92.06,9.36 92.06,10 92.17,10.11 92.93,10.11 93.04,10 93.04,8.95 93.25,8.74 | L28.R 87.21,8.71 87.28,8.71 | 87.28,8.71 88.41,8.71 89.06,9.36 89.06,10 89.17,10.11 89.93,10.11 90.04,10 90.04,8.88 90.21,8.71 | L27.R 84.21,8.71 84.34,8.71 | 84.34,8.71 85.41,8.71 86.06,9.36 86.06,10 86.17,10.11 86.93,10.11 87.04,10 87.04,8.95 87.28,8.71 | L26.R 81.21,8.71 | 81.21,8.71 82.41,8.71 83.06,9.36 83.06,10 83.17,10.11 83.93,10.11 84.04,10 84.04,9 84.34,8.71 | L25.R 78.21,8.71 78.32,8.71
  Top 0.127: 78.32,8.71 79.41,8.71 80.06,9.36 80.06,10 80.17,10.11 80.93,10.11 81.04,10 81.04,8.88 81.21,8.71 | L24.R 75.18,8.68 | 75.18,8.68 75.21,8.71 76.41,8.71 77.06,9.36 77.06,10 77.17,10.11 77.93,10.11 78.04,10 78.04,8.98 78.32,8.71 | 75.18,8.68 75.04,8.81 75.04,10 74.93,10.11 74.17,10.11 74.06,10 74.06,9.36 73.39,8.69 72.19,8.69 | L23.R 72.19,8.69 | L22.R 69.19,8.69 69.4,8.69 | 69.4,8.69 70.39,8.69 71.06,9.36 71.06,10 71.17,10.11 71.93,10.11 72.04,10 72.04,8.84 72.19,8.69 | v69.4,8.15 69.4,8.69 | L42.R 129.33,8.1 129.92,8.69 129.98,8.69 | 129.98,8.69 130.39,8.69 131.06,9.36 131.06,10 131.17,10.11 131.93,10.11 132.04,10 132.04,9.24 131.6,8.8 L43.R | L41.R 126.19,8.69 127,8.69 | 127,8.69 127.39,8.69 128.06,9.36 128.06,10 128.17,10.11 128.93,10.11 129.04,10 129.04,9.63 129.98,8.69 | 127,8.69
  Bottom 0.127: FET_R2.3 57.83,5.44 61.59,5.44 63.33,7.17 68.42,7.17 v69.4,8.15 | v116.75,8.25 119.65,8.25 | 119.65,8.25 122.62,8.25 | 122.62,8.25 125.45,8.25 L41.R | L40.R 122.62,8.12 122.62,8.25 | L39.R 119.65,8.15 119.65,8.25
  other vias: 125.6,8.1 122.6,8.1 119.6,8.1
RED_S1
  Bottom 0.127: NRF.37 42.04,9.42 33.16,9.42 32.77,9.03 32.77,5.75 32.38,5.36 31.35,5.36 31.22,5.22 31.22,4.75 R_PDW1.1 30.78,4.5 29.51,3.23 29.51,1.91 30.41,1.01 FET_R1.1
RED_S2  (via drill 0.3 pad 0.5)
  Top 0.127: v53.14,3.26 51.71,4.7 v45.32,4.7
  Bottom 0.127: R_PDW2.1 52.72,2.58 FET_R2.1 53.14,3.25 v53.14,3.26 | v45.32,4.7 44.97,5.05 44.97,6.15 45.4,6.58 NRF.27
SCL
  Bottom 0.127: NRF.43 44.54,11.95 43.91,12.58 42.24,12.58 40.62,10.96 38.62,10.96 37.75,11.84 32.81,11.84 32.45,12.19 30.93,12.19 IPUP.2 30.36,11.67 29.28,11.67 28.65,11.04 MPU6050.23
SDA
  Bottom 0.127: NRF.42 44.26,11.67 43.68,12.25 42.28,12.25 40.74,10.71 38.03,10.71 37.93,10.82 32.58,10.82 31.84,11.56 IPUP2.2 31.84,11.26 31.48,10.91 29.37,10.91 28.99,10.53 MPU6050.24
SENSOR  (via drill 0.3 pad 0.5)
  Top 0.127: v25.59,5.44 25.13,5.89 19.84,5.89 v19.52,5.56
  Bottom 0.127: v19.52,5.56 19.53,5.58 19.53,6.48 18.64,7.37 17.82,7.37 17.01,8.18 17.01,9.67 16.51,10.18 | v25.59,5.44 25.97,5.82 28.05,5.82 28.26,6.02 30.35,6.02 30.99,6.67 30.99,8.75 32.44,10.2 40.95,10.2 42.31,11.56 43.26,11.56 NRF.40 | HALL.OUT 14.75,11.18 18.23,11.18 18.95,11.89 P0.28.1 18.95,10.26 HPUP.2 19.03,10.18 16.51,10.18 | 16.51,10.18 12.82,10.18 IR_SENSOR.3
SWDCLK  (via drill 0.3 pad 0.5)
  Top 0.127: v47.28,2.36 U$2.SWDCLK
  Bottom 0.127: NRF.25 47.28,4.72 v47.28,2.36
SWDIO  (via drill 0.3 pad 0.5)
  Top 0.127: v46.01,2.31 v46,2.31 U$2.SWDIO
  Bottom 0.127: v46.01,2.31 46.01,4.88 45.27,5.61 45.27,5.87 NRF.26
USB_VIN  (via drill 0.3, 0.3 pad 0.5)
  Top 0.203: v51.07,1.73 49.75,3.05 45.38,3.05 43.06,0.73 20.5,0.73 v19.7,1.52
  Bottom 0.203: v12.15,3.58 12.15,1.93 12.26,1.83 | R44.2 68.8,4.44 68.8,1.57 68.14,0.91 51.88,0.91 v51.07,1.73 | 19.64,1.59 | v19.7,1.52 19.64,1.59 | U$16.3 18.86,2.37 19.64,1.59 | 12.26,1.83 12.7,1.38 13.81,1.38 14.63,0.56 18.61,0.56 19.64,1.59 | U$19.VBUS1 4.18,6 3.95,6.22 3.95,8.76 4.21,9.02 5.23,9.02 U$19.VBUS2 8.94,9 9.14,8.8 9.14,6.71 7.51,5.08 7.51,1.14 8.14,0.51 10.94,0.51 12.26,1.83
VIN_SW
  Bottom 0.203: U$16.2 15.86,4.17 16.77,5.08 | MOTOR+.P$1 21.57,5.27 20.68,4.38 17.88,4.38 17.36,4.89 17.36,5.08 | REG.3 16.11,6.17 16.11,5.24 16.27,5.08 16.77,5.08 | 17.36,5.08 16.77,5.08 | REG.1 17.97,5.69 17.36,5.08

## Text on the board
bNames: GND | BAT | GND | GND | BAT | BAT